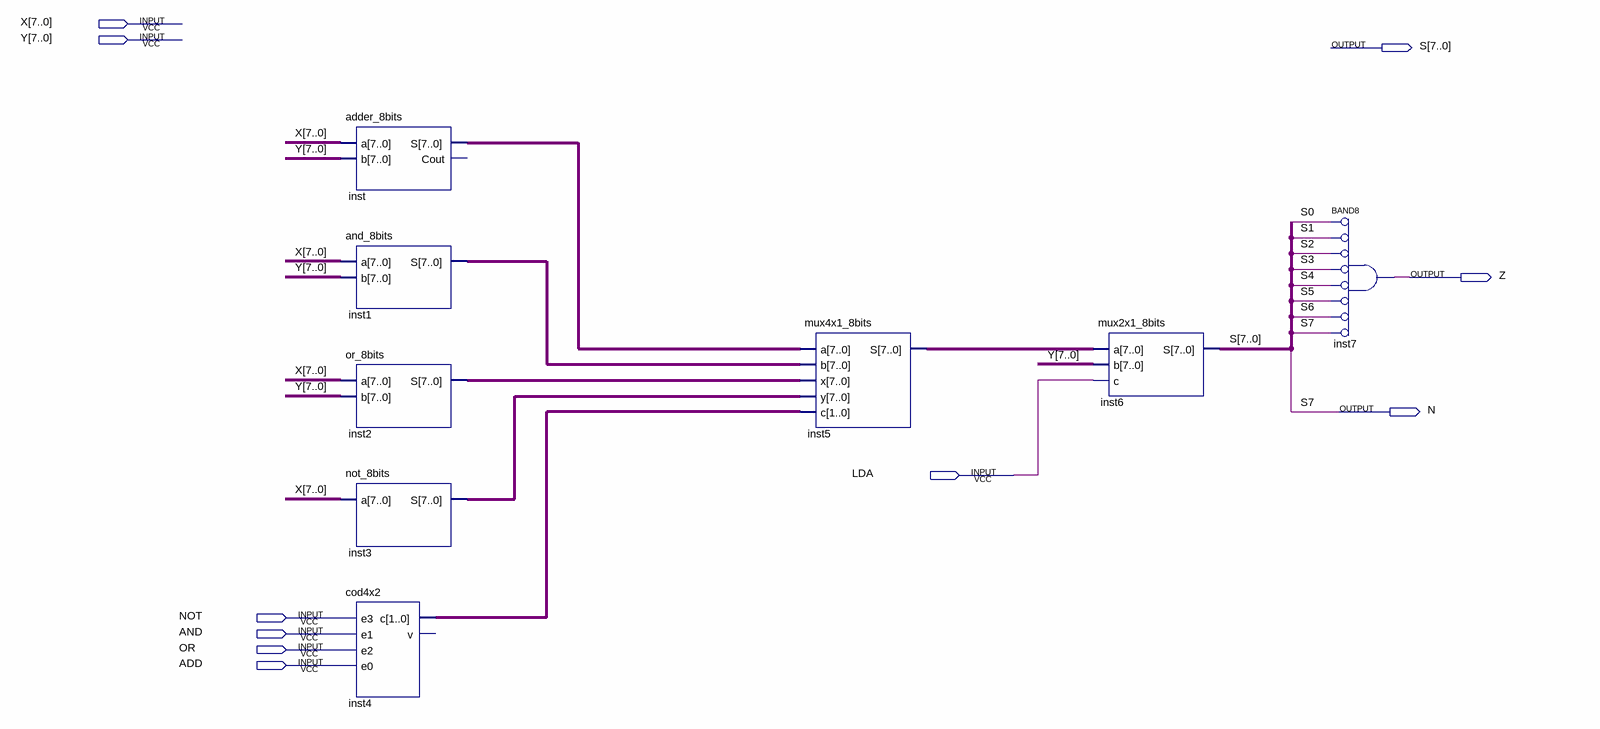
[diagram p0: schematic sheet]
// Quartus schematic ula_8bits.bdf as structural Verilog: 8 symbols, 10 pins
module ula_8bits (
  input  [7:0] X,
  input  [7:0] Y,
  input  LDA,
  input  NOT,
  input  AND,
  input  OR,
  input  ADD,
  output [7:0] S,
  output Z,
  output N
);

  wire [1:0] inst4_c;
  wire [7:0] inst1_s, inst2_s, inst3_s, inst5_s, inst_s;

  adder_8bits inst (.a(X), .b(Y), .S(inst_s));  // open: Cout
  and_8bits inst1 (.a(X), .b(Y), .S(inst1_s));
  or_8bits inst2 (.a(X), .b(Y), .S(inst2_s));
  not_8bits inst3 (.a(X), .S(inst3_s));
  cod4x2 inst4 (.e3(NOT), .e1(AND), .e2(OR), .e0(ADD), .c(inst4_c));  // open: v
  mux4x1_8bits inst5 (.a(inst_s), .b(inst1_s), .x(inst2_s), .y(inst3_s), .c(inst4_c), .S(inst5_s));
  mux2x1_8bits inst6 (.a(inst5_s), .b(Y), .c(LDA), .S({N, S[6:0]}));
  and inst7 (Z, ~S[0], ~S[1], ~S[2], ~S[3], ~S[4], ~S[5], ~S[6], ~N);  // BAND8

  assign S[7] = N;

  // Other names for the same wires on the sheet: S7 = N
endmodule
